# Altium project DRV8462_DevBrd.PrjPcb
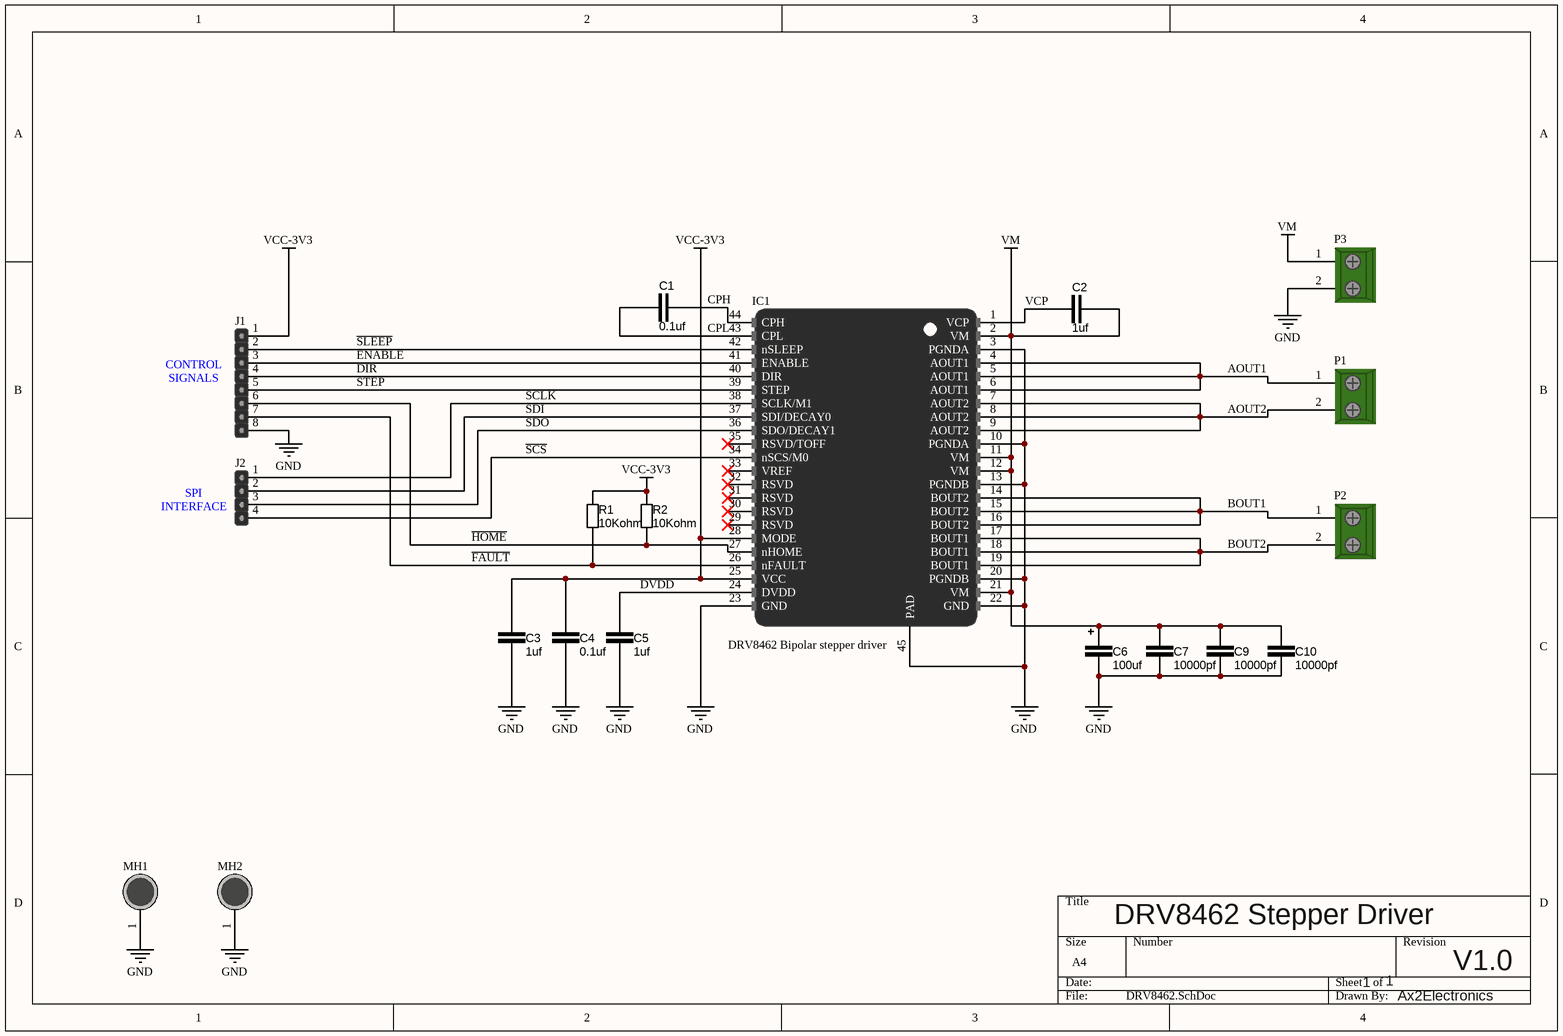
[diagram p0: DRV8462.SchDoc]
1 sheet, 19 parts. Net scope: global (net labels, ports and power ports of the same name join across sheets).
Board file: DRV8462.PcbDoc

## Sheet DRV8462.SchDoc: DRV8462 Stepper Driver
size A4; DrawnBy: Ax2Electronics; Revision: V1.0; SheetNumber: 1; SheetTotal: 1

### Parts
C1  0.1uf  [CAP_0603]
C2  1uf  [CAP_0603]
C3  1uf  [CAP_0603]
C4  0.1uf  [CAP_0603]
C5  1uf  [CAP_0603]
C6  100uf  [CAPAE7366X60M]
C7  10000pf  [CAP_0603]
C9  10000pf  [CAP_0603]
C10  10000pf  [CAP_0603]
IC1  DRV8462 Bipolar stepper driver  [TSOP64P810X120_HS-45N]
J1  Header 8 PIN  [HEADER_8PIN]  (value not drawn)
J2  Header 4 PIN  [HEADER_4PIN]  (value not drawn)
MH1  Mounting Hole  [HOLE-3mm]  (value not drawn)
MH2  Mounting Hole  [HOLE-3mm]  (value not drawn)
P1  Terminal Block  [TERM_BLOCK 5mm 2PIN]  (value not drawn)
P2  Terminal Block  [TERM_BLOCK 5mm 2PIN]  (value not drawn)
P3  Terminal Block  [TERM_BLOCK 5mm 2PIN]  (value not drawn)
R1  10Kohm  [RES_0603]
R2  10Kohm  [RES_0603]

### Nets
GND: C3.2 C4.1 C5.1 C6.1 C7.1 C9.1 C10.1 IC1.3(PGNDA) IC1.10(PGNDA) IC1.13(PGNDB) IC1.20(PGNDB) IC1.22(GND) IC1.23(GND) IC1.45(PAD) J1.8 MH1.1 MH2.1 P3.2(pin2)
VCC-3V3: C3.1 C4.2 IC1.25(VCC) IC1.28(MODE) J1.1 R1.2 R2.2
VM: C2.2 C6.2 C7.2 C9.2 C10.2 IC1.2(VM) IC1.11(VM) IC1.12(VM) IC1.21(VM) P3.1(pin1)
~{FAULT}: IC1.26(nFAULT) J1.7 R1.1
~{HOME}: IC1.27(nHOME) J1.6 R2.1
~{SCS}: IC1.34(nSCS/M0) J2.4
~{SLEEP}: IC1.42(nSLEEP) J1.2
AOUT1: IC1.4(AOUT1) IC1.5(AOUT1) IC1.6(AOUT1) P1.1(pin1)
AOUT2: IC1.7(AOUT2) IC1.8(AOUT2) IC1.9(AOUT2) P1.2(pin2)
BOUT1: IC1.14(BOUT2) IC1.15(BOUT2) IC1.16(BOUT2) P2.1(pin1)
BOUT2: IC1.17(BOUT1) IC1.18(BOUT1) IC1.19(BOUT1) P2.2(pin2)
CPH: C1.2 IC1.44(CPH)
CPL: C1.1 IC1.43(CPL)
DIR: IC1.40(DIR) J1.4
DVDD: C5.2 IC1.24(DVDD)
ENABLE: IC1.41(ENABLE) J1.3
SCLK: IC1.38(SCLK/M1) J2.1
SDI: IC1.37(SDI/DECAY0) J2.2
SDO: IC1.36(SDO/DECAY1) J2.3
STEP: IC1.39(STEP) J1.5
VCP: C2.1 IC1.1(VCP)

Not connected (* = marked no-connect by the designer): IC1 29(RSVD)* 30(RSVD)* 31(RSVD)* 32(RSVD)* 33(VREF)* 35(RSVD/TOFF)*

### Notes on the sheet
- (near J1) CONTROL
  SIGNALS
- (near J2) SPI
  INTERFACE

### Library data of the parts
C1 C4 = 0000012: CAP CER 0.1uF 10V X7R 0603; capaticanse: 0.1uf; ComponentLink1Description: digikey; ComponentLink1URL: https://www.digikey.com/en/products/detail/w%C3%BCrth-elektronik/885012206020/5453794; Digikey part number: 732-7939-2-ND
C2 C5 = 0000009: CAP CER 1uF 0603 16V X7R; capaticanse: 1uf; ComponentLink1Description: digikey; ComponentLink1URL: https://www.digikey.com/en/products/detail/samsung-electro-mechanics/CL10B105KO8NNNC/3886677; DigiKey part number: 1276-1019-2-ND
C3 = 0000011: CAP CER 1uF 10V X7R 0603; capaticanse: 1uf; ComponentLink1Description: digikey; ComponentLink1URL: https://www.digikey.com/en/products/detail/samsung-electro-mechanics/CL10B105KP8NNNC/3887604; DigiKey part number: 1276-1946-2-ND
C6 = 0000013: CAP ALUM POLY 100UF 20% 63V SMD; capaticanse: 100uf; ComponentLink1Description: digikey; ComponentLink1URL: https://www.digikey.com/en/products/detail/kemet/A767MU107M1JLAE028/7392906; DigiKey part number: 399-15648-2-ND
C7 C9 C10 = 0000010: CAP CER 10000PF 63V X7R 0603; capaticanse: 10000pf; ComponentLink1Description: digikey; ComponentLink1URL: https://www.digikey.com/en/products/detail/knowles-syfer/060330630103KXT/6565244; Digikey part number: 1608-1294-2-ND
IC1 = DRV8462: 65-V, 10-A, DUAL H-BRIDGE STEPPER DRIVER; Digikey part number: 296-DRV8462DDWRTR-ND; ComponentLink1Description: DigiKey; ComponentLink1URL: https://www.digikey.com/en/products/detail/texas-instruments/DRV8462DDWR/17395001?s=N4IgTCBcDaICYCcBuAOALANggXQL5A; Mouser part number: 595-DRV8462DDWR; ComponentLink2Description: Mouser; ComponentLink2URL: https://eu.mouser.com/ProductDetail/Texas-Instruments/DRV8462DDWR?qs=rQFj71Wb1eVexvYNsDfnvA%3D%3D; ComponentLink3Description: datasheet; ComponentLink3URL: https://www.ti.com/lit/ds/symlink/drv8462.pdf
J1 = 00000005
J2 = 00000004
MH1 MH2 = 00000006: Mounting Hole 3mm
P1-P3 = 00000001: Terminal block 90 deg 5mm 2PIN; ComponentLink1Description: DigiKey; ComponentLink1URL: https://www.digikey.com/en/products/detail/adam-tech/EB20-02-C/9831508; DigiKey part number: 2057-EB20-02-C-ND
R1 R2 = R000001: RES 10K OHM 1% 1/10W 0603; resistance: 10Kohm; ComponentLink1Description: digikey; ComponentLink1URL: https://www.digikey.com/en/products/detail/vishay-beyschlag-draloric-bc-components/MCT06030C1002FP500/1850440